# Altium schematic sheet POWER_CONTROL.SchDoc
size A3; DocumentNumber: 3; SheetNumber: 3; SheetTotal: 9
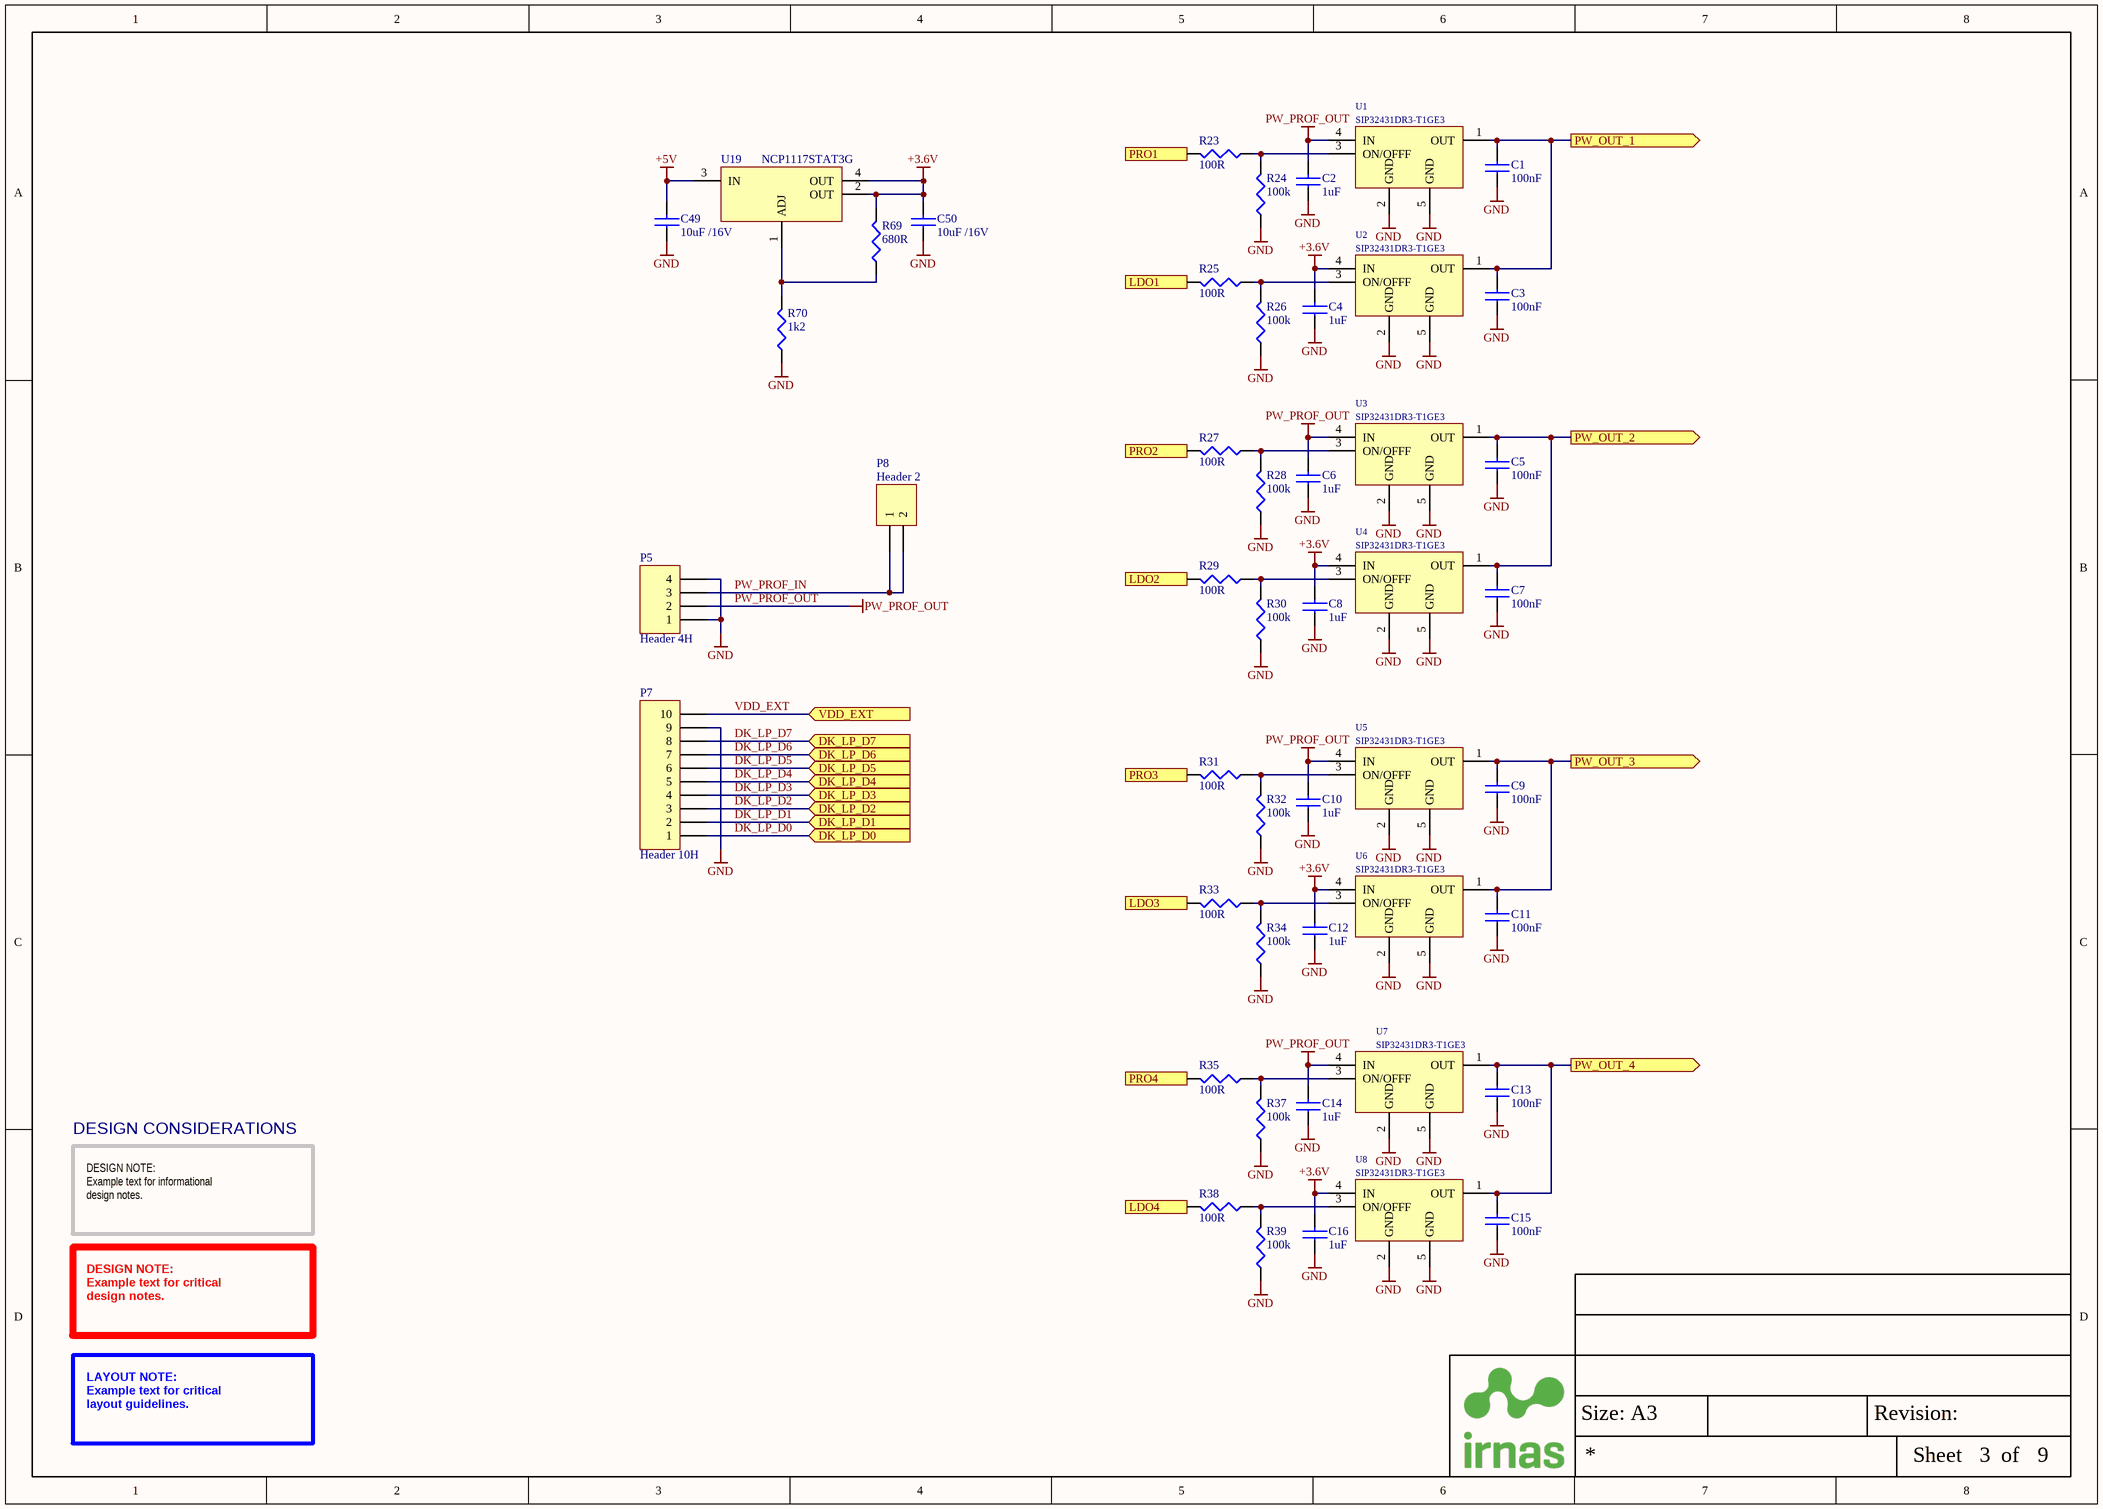
[diagram p0: POWER_CONTROL.SchDoc]

## Parts
C1  100nF  [CAP0402]
C2  1uF  [CAP0402]
C3  100nF  [CAP0402]
C4  1uF  [CAP0402]
C5  100nF  [CAP0402]
C6  1uF  [CAP0402]
C7  100nF  [CAP0402]
C8  1uF  [CAP0402]
C9  100nF  [CAP0402]
C10  1uF  [CAP0402]
C11  100nF  [CAP0402]
C12  1uF  [CAP0402]
C13  100nF  [CAP0402]
C14  1uF  [CAP0402]
C15  100nF  [CAP0402]
C16  1uF  [CAP0402]
C49  10uF /16V  [CAP0805]
C50  10uF /16V  [CAP0805]
P5  Header 4H  [HDR1X4H]
P7  Header 10H  [HDR1X10H]
P8  Header 2  [HDR1X2]
R23  100R  [RES0402]
R24  100k  [RES0402]
R25  100R  [RES0402]
R26  100k  [RES0402]
R27  100R  [RES0402]
R28  100k  [RES0402]
R29  100R  [RES0402]
R30  100k  [RES0402]
R31  100R  [RES0402]
R32  100k  [RES0402]
R33  100R  [RES0402]
R34  100k  [RES0402]
R35  100R  [RES0402]
R37  100k  [RES0402]
R38  100R  [RES0402]
R39  100k  [RES0402]
R69  680R  [RES0402]
R70  1k2  [RES0402]
U1  SIP32431DR3-T1GE3  [SC70-6]
U2  SIP32431DR3-T1GE3  [SC70-6]
U3  SIP32431DR3-T1GE3  [SC70-6]
U4  SIP32431DR3-T1GE3  [SC70-6]
U5  SIP32431DR3-T1GE3  [SC70-6]
U6  SIP32431DR3-T1GE3  [SC70-6]
U7  SIP32431DR3-T1GE3  [SC70-6]
U8  SIP32431DR3-T1GE3  [SC70-6]
U19  NCP1117STAT3G  [SOT223-3]

## Ports
DK_LP_D0 (in), DK_LP_D1 (in), DK_LP_D2 (in), DK_LP_D3 (in), DK_LP_D4 (in), DK_LP_D5 (in), DK_LP_D6 (in), DK_LP_D7 (in), LDO1 (in), LDO2 (in), LDO3 (in), LDO4 (in), PRO1 (in), PRO2 (in), PRO3 (in), PRO4 (in), PW_OUT_1 (out), PW_OUT_2 (out), PW_OUT_3 (out), PW_OUT_4 (out), VDD_EXT (in)

## Nets
+3.6V: C4.2 C8.2 C12.2 C16.2 C50.2 R69.2 U2.4(IN) U4.4(IN) U6.4(IN) U8.4(IN) U19.2(OUT) U19.4(OUT)
+5V: C49.2 U19.3(IN)
GND: C1.1 C2.1 C3.1 C4.1 C5.1 C6.1 C7.1 C8.1 C9.1 C10.1 C11.1 C12.1 C13.1 C14.1 C15.1 C16.1 C49.1 C50.1 P5.1 P5.4 P7.9 R24.1 R26.1 R28.1 R30.1 R32.1 R34.1 R37.1 R39.1 R70.1 U1.2(GND) U1.5(GND) U2.2(GND) U2.5(GND) U3.2(GND) U3.5(GND) U4.2(GND) U4.5(GND) U5.2(GND) U5.5(GND) U6.2(GND) U6.5(GND) U7.2(GND) U7.5(GND) U8.2(GND) U8.5(GND)
PW_PROF_OUT: C2.2 C6.2 C10.2 C14.2 P5.2 U1.4(IN) U3.4(IN) U5.4(IN) U7.4(IN)
DK_LP_D0: P7.1 ; port DK_LP_D0
DK_LP_D1: P7.2 ; port DK_LP_D1
DK_LP_D2: P7.3 ; port DK_LP_D2
DK_LP_D3: P7.4 ; port DK_LP_D3
DK_LP_D4: P7.5 ; port DK_LP_D4
DK_LP_D5: P7.6 ; port DK_LP_D5
DK_LP_D6: P7.7 ; port DK_LP_D6
DK_LP_D7: P7.8 ; port DK_LP_D7
LDO1: R25.2 ; port LDO1
LDO2: R29.2 ; port LDO2
LDO3: R33.2 ; port LDO3
LDO4: R38.2 ; port LDO4
PRO1: R23.2 ; port PRO1
PRO2: R27.2 ; port PRO2
PRO3: R31.2 ; port PRO3
PRO4: R35.2 ; port PRO4
PW_OUT_1: C1.2 C3.2 U1.1(OUT) U2.1(OUT) ; port PW_OUT_1
PW_OUT_2: C5.2 C7.2 U3.1(OUT) U4.1(OUT) ; port PW_OUT_2
PW_OUT_3: C9.2 C11.2 U5.1(OUT) U6.1(OUT) ; port PW_OUT_3
PW_OUT_4: C13.2 C15.2 U7.1(OUT) U8.1(OUT) ; port PW_OUT_4
PW_PROF_IN: P5.3 P8.1 P8.2
VDD_EXT: P7.10 ; port VDD_EXT
NetR23_1: R23.1 R24.2 U1.3(ON/OFFF)
NetR25_1: R25.1 R26.2 U2.3(ON/OFFF)
NetR27_1: R27.1 R28.2 U3.3(ON/OFFF)
NetR29_1: R29.1 R30.2 U4.3(ON/OFFF)
NetR31_1: R31.1 R32.2 U5.3(ON/OFFF)
NetR33_1: R33.1 R34.2 U6.3(ON/OFFF)
NetR35_1: R35.1 R37.2 U7.3(ON/OFFF)
NetR38_1: R38.1 R39.2 U8.3(ON/OFFF)
NetR69_1: R69.1 R70.2 U19.1(ADJ)

## Notes on the sheet
- DESIGN CONSIDERATIONS
- DESIGN NOTE:
  Example text for informational
  design notes.
- DESIGN NOTE:
  Example text for critical
  design notes.
- LAYOUT NOTE:
  Example text for critical
  layout guidelines.
- Size: A3
- Revision:
- Sheet
- of

## Library data of the parts
C1 C3 C5 C7 C9 C11 C13 C15 = C - 100nF/0402: MULTICOMP         MC0402X104J160CT             SMD Multilayer Ceramic Capacitor, 0402 [1005 Metric], 0.1 F, 16 V,  5%, X5R, MC Series                          New; IRNAS Part No.: /; Voltage Rating: 16V; Supplier 1: Farnell; Manufacturer: Multicomp; Manufacturer Part Number: MC0402X104J160CT; Stock 1: 3230; Pricing 1: 10=0.0139, 100=0.0108, 500=0.0076, 2500=0.0051, 5000=0.0038 (EUR); Case Code (Metric): 1005; Case Code (Imperial): 0402; Min Operating Temperature: -55°C; Max Operating Temperature: 85°C; Capacitance: 100nF; Dielectric: X5R; Packaging: Tape and Reel; Tolerance: 5%; Voltage Rating (DC): 16V; REACH SVHC: No SVHC; ComponentLink1URL: http://www.farnell.com/datasheets/2117933.pdf; ComponentLink1Description: http://www.farnell.com/datasheets/2117933.pdf; ComponentLink2URL: http://www.farnell.com/datasheets/2117900.pdf; ComponentLink2Description: http://www.farnell.com/datasheets/2117900.pdf; Supplier Part Number 1: 2627419
C2 C4 C6 C8 C10 C12 C14 C16 = C - 1uF/0402: CAP CER 1UF 10V 20% X5R 0402; Manufacturer: Murata; Manufacturer Part Number: GRM155R61A105ME15D; IRNAS Part No.: /; Supplier 1: Farnell; Stock 1: 0; Pricing 1: 10=0.0379, 100=0.0266, 500=0.0156, 2500=0.0098, 5000=0.0083 (EUR); Mount: Surface Mount; Case/Package: 0402; Case Code (Metric): 1005; Case Code (Imperial): 0402; Min Operating Temperature: -55°C; Max Operating Temperature: 85°C; Capacitance: 1uF; Tolerance: 20%; Voltage Rating: 10V; Packaging: Tape and Reel; Package Quantity: 1; Dielectric: X5R; Voltage: 10V; Voltage Rating (DC): 10V; Length: 1mm; Height: 0.5mm; Width: 0.02inch; Thickness: 0.022inch; Depth: 0.5mm; Radiation Hardening: No; REACH SVHC: No SVHC; Lead Free: Lead Free; ComponentLink1URL: https://datasheet.ciiva.com/164/product-164665.pdf; ComponentLink1Description: https://datasheet.ciiva.com/164/product-164665.pdf; ComponentLink2URL: https://datasheet.ciiva.com/11616/product-11616508.pdf; ComponentLink2Description: https://datasheet.ciiva.com/11616/product-11616508.pdf; ComponentLink3URL: https://datasheet.ciiva.com/46418/1769893-46418047.pdf; ComponentLink3Description: https://datasheet.ciiva.com/46418/1769893-46418047.pdf; ComponentLink4URL: https://datasheet.ciiva.com/164/partnumbering-e-01-164666.pdf; ComponentLink4Description: https://datasheet.ciiva.com/164/partnumbering-e-01-164666.pdf; ComponentLink5URL: https://datasheet.ciiva.com/164/partnumbering-e-01-164667.pdf; ComponentLink5Description: https://datasheet.ciiva.com/164/partnumbering-e-01-164667.pdf; Supplier Part Number 1: 2426953
C49 C50 = C - 10uF /16V: TDK - CGA4J1X5R1C106K125AC - CAP, MLCC, X5R, 10UF, 16V, 0805; IRNAS Part No.: I-200007; Supplier 1: Farnell; Manufacturer: TDK; Manufacturer Part Number: CGA4J1X5R1C106K125AC; RoHS: YES; Stock 1: 8974; Pricing 1: 5=0.41, 50=0.146, 250=0.131, 500=0.12, 1000=0.103 (GBP); ComponentLink1URL: http://bcove.me/e1v54mtm; ComponentLink1Description: http://bcove.me/e1v54mtm; ComponentLink2URL: http://www.farnell.com/datasheets/1936565.pdf; ComponentLink2Description: http://www.farnell.com/datasheets/1936565.pdf; ComponentLink3URL: http://www.farnell.com/datasheets/1683658.pdf; ComponentLink3Description: http://www.farnell.com/datasheets/1683658.pdf; Supplier Part Number 1: 2210948RL; Capacitance: 10uF; Case/Package: 0805; Case Code (Imperial): 0805
P5 = Header 4H: Header, 4-Pin, Right Angle; LatestRevisionDate: 17-Jul-2002; LatestRevisionNote: Re-released for DXP Platform.; Publisher: Altium Limited
P7 = Header 10H: Header, 10-Pin, Right Angle; LatestRevisionDate: 17-Jul-2002; LatestRevisionNote: Re-released for DXP Platform.; Publisher: Altium Limited
P8 = Header 2: Header, 2-Pin; LatestRevisionDate: 17-Jul-2002; LatestRevisionNote: Re-released for DXP Platform.; Publisher: Altium Limited
R23 R25 R27 R29 R31 R33 R35 R38 = R - 100R/0402: MULTICOMP         MCMR04X1000FTL            SMD Chip Resistor, Ceramic, MCMR Series, 100 ohm, 50 V, 0402 [1005 Metric], 62.5 mW,  1%; IRNAS Part No.: /; Temperature Coefficient: 100ppm/°C; Power Rating: 62.5mW; Voltage Rating: 50V; Supplier 1: Farnell; Manufacturer: Multicomp; Manufacturer Part Number: MCMR04X1000FTL; Stock 1: 62365; Pricing 1: 10=0.0071, 100=0.0042, 500=0.003, 2500=0.0024, 5000=0.0019 (GBP); Case/Package: 0402; Case Code (Metric): 1005; Case Code (Imperial): 0402; Resistance: 100R; Tolerance: 1%; Composition: Ceramic; Packaging: Cut Tape; Voltage Rating (DC): 50V; REACH SVHC: No SVHC; ComponentLink1URL: https://datasheet.ciiva.com/28692/1716705-28692087.pdf; ComponentLink1Description: https://datasheet.ciiva.com/28692/1716705-28692087.pdf; ComponentLink2URL: https://datasheet.ciiva.com/22708/1716705-22708156.pdf; ComponentLink2Description: https://datasheet.ciiva.com/22708/1716705-22708156.pdf; Supplier Part Number 1: 2072515
R24 R26 R28 R30 R32 R34 R37 R39 = R - 100k/0402: MULTICOMP   MCWR04X1003FTL   RES, THICK FILM, 100KOHM, 1%, 0.0625W; IRNAS Part No.: I-100013; Resistance: 100kR; Power Rating: 62.5mW; Voltage Rating: 50V; Temperature Coefficient: 100ppm/°C; Supplier 1: Farnell; Manufacturer: Multicomp; Manufacturer Part Number: MCWR04X1003FTL; Stock 1: 161188; Pricing 1: 10=0.0029, 100=0.0017, 500=0.0012, 2500=0.001, 5000=0.0008 (EUR); Mount: Surface Mount; Case/Package: 0402; Case Code (Metric): 1005; Case Code (Imperial): 0402; Tolerance: 1%; Packaging: Cut Tape; Composition: Thick Film; Voltage Rating (DC): 50V; REACH SVHC: No SVHC; ComponentLink1URL: https://datasheet.ciiva.com/46386/1849611-46386524.pdf; ComponentLink1Description: https://datasheet.ciiva.com/46386/1849611-46386524.pdf; Supplier Part Number 1: 2447094
R69 = R - 680R/0402: RES 680 ohm, ± 1%, 63 mW, 0402; Manufacturer: Vishay; Manufacturer Part Number: CRCW0402680RFKED; IRNAS Part No.: /; Resistance: 510R; Power Rating: 63mW; Voltage Rating: 50V; Temperature Coefficient: 100ppm/°C; Supplier 1: Farnell; Stock 1: 0; Case/Package: 0402; Weight: 2.3E-05oz; Case Code (Imperial): 0402; Case Code (Metric): 1005; Min Operating Temperature: -55°C; Max Operating Temperature: 155°C; Packaging: Tape and Reel; Package Quantity: 1; Termination: SMD/SMT; Tolerance: 1%; Composition: Thick Film; Number of Terminations: 2; Military Standard: Not; Max Power Dissipation: 63mW; Voltage Rating (DC): 50V; Length: 1mm; Height: 0.016inch; Width: 0.5mm; Depth: 0.5mm; REACH SVHC: Unknown; Lead Free: Lead Free; ComponentLink1URL: https://datasheet.ciiva.com/2453/pyu-r-int-thick-7-2453397.pdf; ComponentLink1Description: https://datasheet.ciiva.com/2453/pyu-r-int-thick-7-2453397.pdf; ComponentLink2URL: https://datasheet.ciiva.com/2453/pyu-r-int-thick-7-2453398.pdf; ComponentLink2Description: https://datasheet.ciiva.com/2453/pyu-r-int-thick-7-2453398.pdf; ComponentLink3URL: https://datasheet.ciiva.com/17063/pyu-rc0402-51-rohs-l-6-r-17063430.pdf; ComponentLink3Description: https://datasheet.ciiva.com/17063/pyu-rc0402-51-rohs-l-6-r-17063430.pdf; ComponentLink4URL: https://datasheet.ciiva.com/2453/pyu-r-int-thick-7-2453399.pdf; ComponentLink4Description: https://datasheet.ciiva.com/2453/pyu-r-int-thick-7-2453399.pdf; Supplier Part Number 1: 2140759
R70 = R - 1k2/0402: RES SMD 1.2K OHM 1% 1/16W 0402; Manufacturer: Vishay; Manufacturer Part Number: CRCW04021K20FKED; IRNAS Part No.: /; Power Rating: 63mW; Resistance: 1.2kR; Voltage Rating: 50V; Temperature Coefficient: 100ppm/°C; Supplier 1: Farnell; Stock 1: 3170; Pricing 1: 10=0.0072, 400=0.0053, 1000=0.0043, 2500=0.0041, 5000=0.004 (GBP); Case/Package: 0402; Weight: 2.3E-05oz; Case Code (Metric): 1005; Case Code (Imperial): 0402; Contact Plating: Tin; Min Operating Temperature: -55°C; Max Operating Temperature: 155°C; Composition: Thick Film; Tolerance: 1%; Packaging: Tape and Reel; Package Quantity: 10; Number of Terminations: 2; Military Standard: Not; Termination: SMD/SMT; Max Power Dissipation: 63mW; Voltage Rating (DC): 50V; Length: 1mm; Height: 0.35mm; Width: 0.02inch; Depth: 0.5mm; Radiation Hardening: No; REACH SVHC: Unknown; Lead Free: Lead Free; ComponentLink1URL: https://datasheet.ciiva.com/11811/0900766b80d98824-11811101.pdf; ComponentLink1Description: https://datasheet.ciiva.com/11811/0900766b80d98824-11811101.pdf; ComponentLink2URL: https://datasheet.ciiva.com/3256/dcrcwe3-3256156.pdf; ComponentLink2Description: https://datasheet.ciiva.com/3256/dcrcwe3-3256156.pdf; ComponentLink3URL: https://datasheet.ciiva.com/7777/1697337-7777211.pdf; ComponentLink3Description: https://datasheet.ciiva.com/7777/1697337-7777211.pdf; ComponentLink4URL: https://datasheet.ciiva.com/16436/dcrcwe3-16436187.pdf; ComponentLink4Description: https://datasheet.ciiva.com/16436/dcrcwe3-16436187.pdf; ComponentLink5URL: https://datasheet.ciiva.com/8336/dcrcwe3-8336654.pdf; ComponentLink5Description: https://datasheet.ciiva.com/8336/dcrcwe3-8336654.pdf; ComponentLink6URL: https://datasheet.ciiva.com/5551/dcrcwe3-109170-5551310.pdf; ComponentLink6Description: https://datasheet.ciiva.com/5551/dcrcwe3-109170-5551310.pdf; ComponentLink7URL: https://datasheet.ciiva.com/22704/1697337-22704428.pdf; ComponentLink7Description: https://datasheet.ciiva.com/22704/1697337-22704428.pdf; ComponentLink8URL: https://datasheet.ciiva.com/2463/dcrcwe3-2463270.pdf; ComponentLink8Description: https://datasheet.ciiva.com/2463/dcrcwe3-2463270.pdf; ComponentLink9URL: https://datasheet.ciiva.com/2463/dcrcwe3-2463269.pdf; ComponentLink9Description: https://datasheet.ciiva.com/2463/dcrcwe3-2463269.pdf; ComponentLink10URL: https://datasheet.ciiva.com/2463/dcrcwe3-2463268.pdf; ComponentLink10Description: https://datasheet.ciiva.com/2463/dcrcwe3-2463268.pdf; ComponentLink11URL: https://datasheet.ciiva.com/16881/dcrcwe3-16881079.pdf; ComponentLink11Description: https://datasheet.ciiva.com/16881/dcrcwe3-16881079.pdf; ComponentLink12URL: https://datasheet.ciiva.com/7777/1697337-7777210.pdf; ComponentLink12Description: https://datasheet.ciiva.com/7777/1697337-7777210.pdf; ComponentLink13URL: https://datasheet.ciiva.com/16777/70201119-16777273.pdf; ComponentLink13Description: https://datasheet.ciiva.com/16777/70201119-16777273.pdf; ComponentLink14URL: https://datasheet.ciiva.com/26316/fld-crcw-e3-data-en-26316647.pdf; ComponentLink14Description: https://datasheet.ciiva.com/26316/fld-crcw-e3-data-en-26316647.pdf; Supplier Part Number 1: 2140783
U1-U8 = SW - SIP32431DR3-T1GE3: Power Load Switch, Reverse Blocking, High Side, Active High, Active Low, 1 Output, 5.5V, 1A; Opis / Description: SIP32431DR3-T1GE3; Value: SIP32431DR3-T1GE3; Velikost / Size: SC70-6; ComponentLink1Description: DataSheet; ComponentLink1URL: D:\altium\Altium_Library\Active\Datasheet\SIP32431DR3.pdf; Supplier 1: Farnell; Supplier Part Number 1: 2361509
U19 = V_LIN - NCP1117STAT3G: LDO Voltage Regulator, Adjustable, 3.5V to 20V in, 1.07V drop, 1.25V to 18.8V/1A out, SOT-223-3; Manufacturer: ON SEMICONDUCTOR; Topology: Buck (Step Down); Input Voltage Min: 4.5; Input Voltage Max: 45; No. of Outputs: 1; DC / DC Converter IC Case: TO-263; No. of Pins: 5; Output Current: 3; Output Voltage Min: 1.23; Output Voltage Max: 37; Switching Frequency: 150; SVHC: No SVHC (12-Jan-2017; Manufacturer Part Number: NCP1117STAT3G; RoHS: YES; Stock 1: 342; Pricing 1: 1=1.98, 10=1.49, 100=1.19, 500=1.04, 1000=0.859, 2500=0.785 (GBP); Operating Temperature Max: 125; Packaging: Each; Product Range: -; Automotive Qualification Standard: -; MSL: MSL 1 - Unlimited; Supplier 1: Farnell; Supplier Part Number 1: 1703381